# EAGLE design xmas-tree (EAGLE 7.5.0)
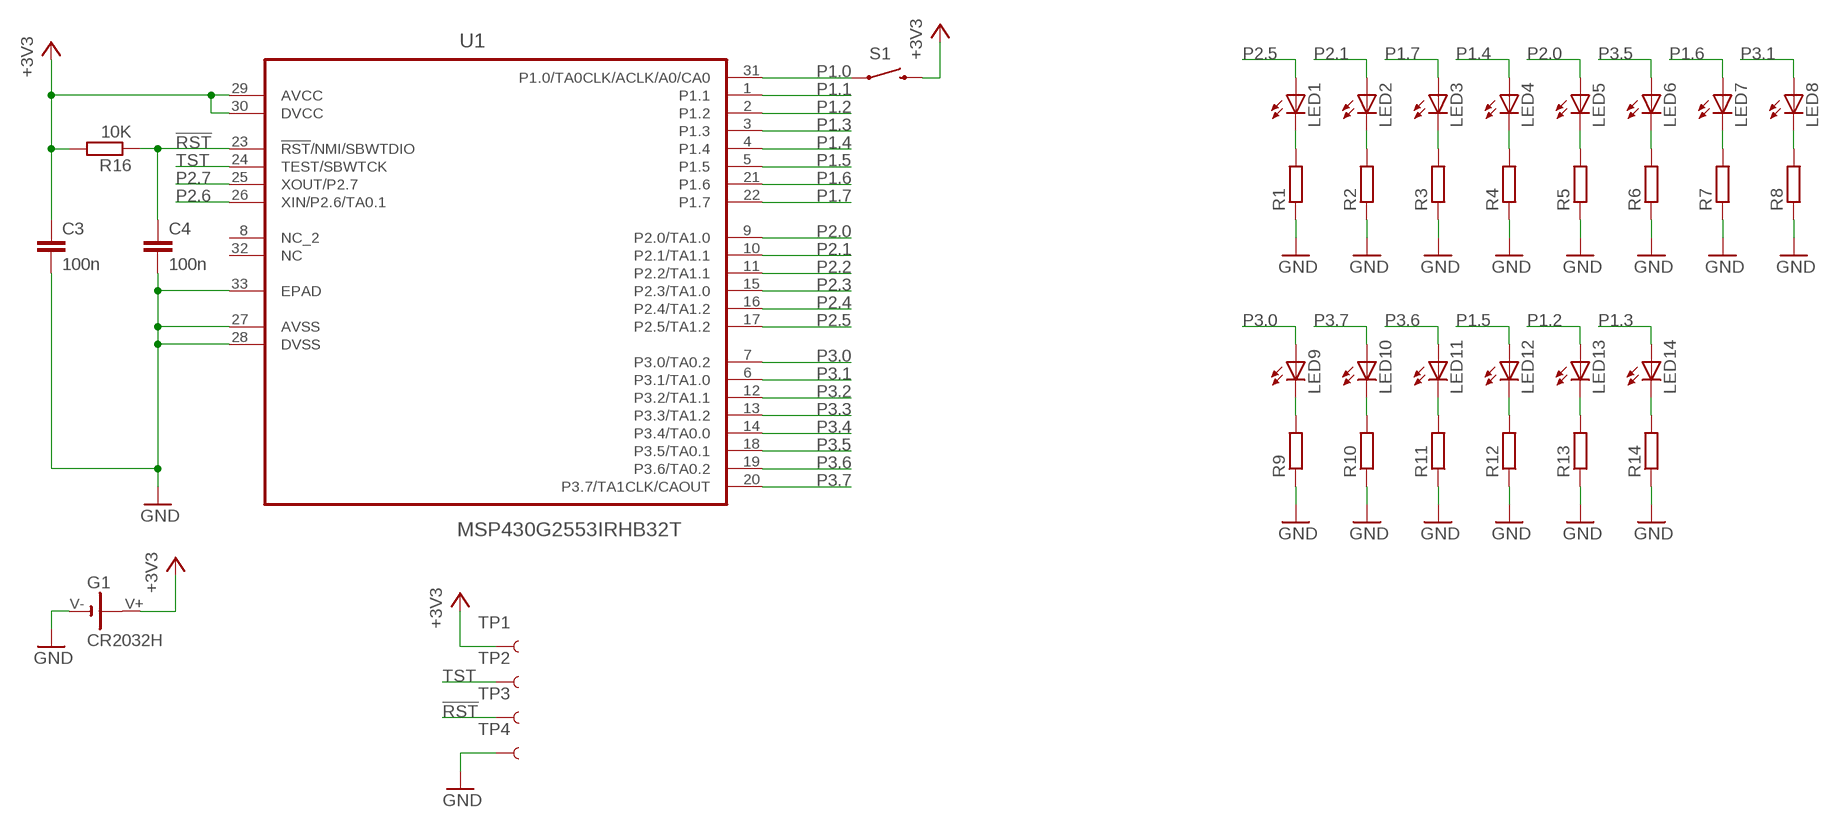
[diagram p0: schematic, sheet 1]

## Parts
C3  100n  C-EUC0603  [C0603]
C4  100n  C-EUC0603  [C0603]
G1  CR2032H  [CH7410-2032LF]
LED1  LEDCHIPLED_0603  [CHIPLED_0603]
LED2  LEDCHIPLED_0603  [CHIPLED_0603]
LED3  LEDCHIPLED_0603  [CHIPLED_0603]
LED4  LEDCHIPLED_0603  [CHIPLED_0603]
LED5  LEDCHIPLED_0603  [CHIPLED_0603]
LED6  LEDCHIPLED_0603  [CHIPLED_0603]
LED7  LEDCHIPLED_0603  [CHIPLED_0603]
LED8  LEDCHIPLED_0603  [CHIPLED_0603]
LED9  LEDCHIPLED_0603  [CHIPLED_0603]
LED10  LEDCHIPLED_0603  [CHIPLED_0603]
LED11  LEDCHIPLED_0603  [CHIPLED_0603]
LED12  LEDCHIPLED_0603  [CHIPLED_0603]
LED13  LEDCHIPLED_0603  [CHIPLED_0603]
LED14  LEDCHIPLED_0603  [CHIPLED_0603]
R1  R-EU_R0603  [R0603]
R2  R-EU_R0603  [R0603]
R3  R-EU_R0603  [R0603]
R4  R-EU_R0603  [R0603]
R5  R-EU_R0603  [R0603]
R6  R-EU_R0603  [R0603]
R7  R-EU_R0603  [R0603]
R8  R-EU_R0603  [R0603]
R9  R-EU_R0603  [R0603]
R10  R-EU_R0603  [R0603]
R11  R-EU_R0603  [R0603]
R12  R-EU_R0603  [R0603]
R13  R-EU_R0603  [R0603]
R14  R-EU_R0603  [R0603]
R16  10K  R-EU_R0603  [R0603]
S1  SWITCH-MOMENTARY-2SMD-REDUNDANT  [TACTILE-SWITCH-SMD]
TP1  +3V3  TEST-POINT3X5  [PAD.03X.05]
TP2  TST  TEST-POINT3X5  [PAD.03X.05]
TP3  RST  TEST-POINT3X5  [PAD.03X.05]
TP4  GND  TEST-POINT3X5  [PAD.03X.05]
U1  MSP430G2553IRHB32T  [QFN50P500X500X100-33N]

## Nets
!RST!: C4.1 R16.1 TP3.P$1 U1.23(!RST!/NMI/SBWTDIO)
+3V3: C3.1 G1.V+ R16.2 S1.3 S1.4 TP1.P$1 U1.29(AVCC) U1.30(DVCC)
GND: C3.2 C4.2 G1.V- R1.1 R2.1 R3.1 R4.1 R5.1 R6.1 R7.1 R8.1 R9.1 R10.1 R11.1 R12.1 R13.1 R14.1 TP4.P$1 U1.27(AVSS) U1.28(DVSS) U1.33(EPAD)
N$3: LED1.C R1.2
N$4: LED2.C R2.2
N$5: LED3.C R3.2
N$6: LED4.C R4.2
N$7: LED5.C R5.2
N$8: LED6.C R6.2
N$9: LED7.C R7.2
N$10: LED8.C R8.2
N$11: LED9.C R9.2
N$12: LED10.C R10.2
N$13: LED11.C R11.2
N$14: LED12.C R12.2
N$15: LED13.C R13.2
N$16: LED14.C R14.2
P1.0: S1.1 S1.2 U1.31(P1.0/TA0CLK/ACLK/A0/CA0)
P1.1: U1.1(P1.1)
P1.2: LED13.A U1.2(P1.2)
P1.3: LED14.A U1.3(P1.3)
P1.4: LED4.A U1.4(P1.4)
P1.5: LED12.A U1.5(P1.5)
P1.6: LED7.A U1.21(P1.6)
P1.7: LED3.A U1.22(P1.7)
P2.0: LED5.A U1.9(P2.0/TA1.0)
P2.1: LED2.A U1.10(P2.1/TA1.1)
P2.2: U1.11(P2.2/TA1.1)
P2.3: U1.15(P2.3/TA1.0)
P2.4: U1.16(P2.4/TA1.2)
P2.5: LED1.A U1.17(P2.5/TA1.2)
P2.6: U1.26(XIN/P2.6/TA0.1)
P2.7: U1.25(XOUT/P2.7)
P3.0: LED9.A U1.7(P3.0/TA0.2)
P3.1: LED8.A U1.6(P3.1/TA1.0)
P3.2: U1.12(P3.2/TA1.1)
P3.3: U1.13(P3.3/TA1.2)
P3.4: U1.14(P3.4/TA0.0)
P3.5: LED6.A U1.18(P3.5/TA0.1)
P3.6: LED11.A U1.19(P3.6/TA0.2)
P3.7: LED10.A U1.20(P3.7/TA1CLK/CAOUT)
TST: TP2.P$1 U1.24(TEST/SBWTCK)
Unconnected: U1.8(NC_2) U1.32(NC)

## Library data of the parts
C3 C4 = rcl:C-EU: CAPACITOR, European symbol
G1 = my_library:CR2032H: LI BATTERY Varta
LED1-LED14 = led:LED: LED OSRAM: - CHIPLED LG R971, LG N971, LY N971, LG Q971, LY Q971, LO R971, LY R971 LH N974, LH R974 LS Q976, LO Q976, LY Q976 LO Q996 - Hyper CHIPLED LW Q18S LB Q993, LB Q99A, LB R99A - SideLED LS A670, LO A670, LY A670, LG A670, LP A670 LB A673, LV A673, LT A673, LW A673 LH A674 LY A675 LS A676, LA A676, LO A676, LY A676, LW A676 LS A679, LY A679, LG A679 - Hyper Micro SIDELED® LS Y876, LA Y876, LO Y876, LY Y876 LT Y87S - SmartLED LW L88C, LW L88S LB L89C, LB L89S, LG L890 LS L89K, LO L89K, LY L89K LS L896, LA L896, LO L896, LY L896 - TOPLED LS T670, LO T670, LY T670, LG T670, LP T670 LSG T670, LSP T670, LSY T670, LOP T670, LYG T670 LG T671, LOG T671, LSG T671 LB T673, LV T673, LT T673, LW T673 LH T674 LS T676, LA T676, LO T676, LY T676, LB T676, LH T676, LSB T676, LW T676 LB T67C, LV T67C, LT T67C, LS T67K, LO T67K, LY T67K, LW E67C LS E67B, LA E67B, LO E67B, LY E67B, LB E67C, LV E67C, LT E67C LW T67C LS T679, LY T679, LG T679 LS T770, LO T770, LY T770, LG T770, LP T770 LB T773, LV T773, LT T773, LW T773 LH T774 LS E675, LA E675, LY E675, LS T675 LS T776, LA T776, LO T776, LY T776, LB T776 LHGB T686 LT T68C, LB T68C - Hyper Mini TOPLED® LB M676 - Mini TOPLED Santana® LG M470 LS M47K, LO M47K, LY M47K Source: http://www.osram.convergy.de LUXEON: - LUMILED® LXK2-PW12-R00, LXK2-PW12-S00, LXK2-PW14-U00, LXK2-PW14-V00 LXK2-PM12-R00, LXK2-PM12-S00, LXK2-PM14-U00 LXK2-PE12-Q00, LXK2-PE12-R00, LXK2-PE12-S00, LXK2-PE14-T00, LXK2-PE14-U00 LXK2-PB12-K00, LXK2-PB12-L00, LXK2-PB12-M00, LXK2-PB14-N00, LXK2-PB14-P00, LXK2-PB14-Q00 LXK2-PR12-L00, LXK2-PR12-M00, LXK2-PR14-Q00, LXK2-PR14-R00 LXK2-PD12-Q00, LXK2-PD12-R00, LXK2-PD12-S00 LXK2-PH12-R00, LXK2-PH12-S00 LXK2-PL12-P00, LXK2-PL12-Q00, LXK2-PL12-R00 Source: www.luxeon.com KINGBRIGHT: KA-3528ASYC Source: www.kingbright.com
R1-R14 R16 = rcl:R-EU_: RESISTOR, European symbol
S1 = SparkFun-Electromechanical:SWITCH-MOMENTARY-2: Various NO switches- pushbuttons, reed, etc; PROD_ID: SWCH-08247
TP1-TP4 = SparkFun-Passives:TEST-POINT: Bare copper test points for troubleshooting or ICT
U1 = custom_lbr:MSP430G2553IRHB32T: MIXED SIGNAL MICROCONTROLLER,QFN-32; MPN: MSP430G2553IRHB32T; OC_FARNELL: 1903590; OC_NEWARK: 48T4379; PACKAGE: QFN-32; SUPPLIER: TEXAS INSTRUMENTS

## Board
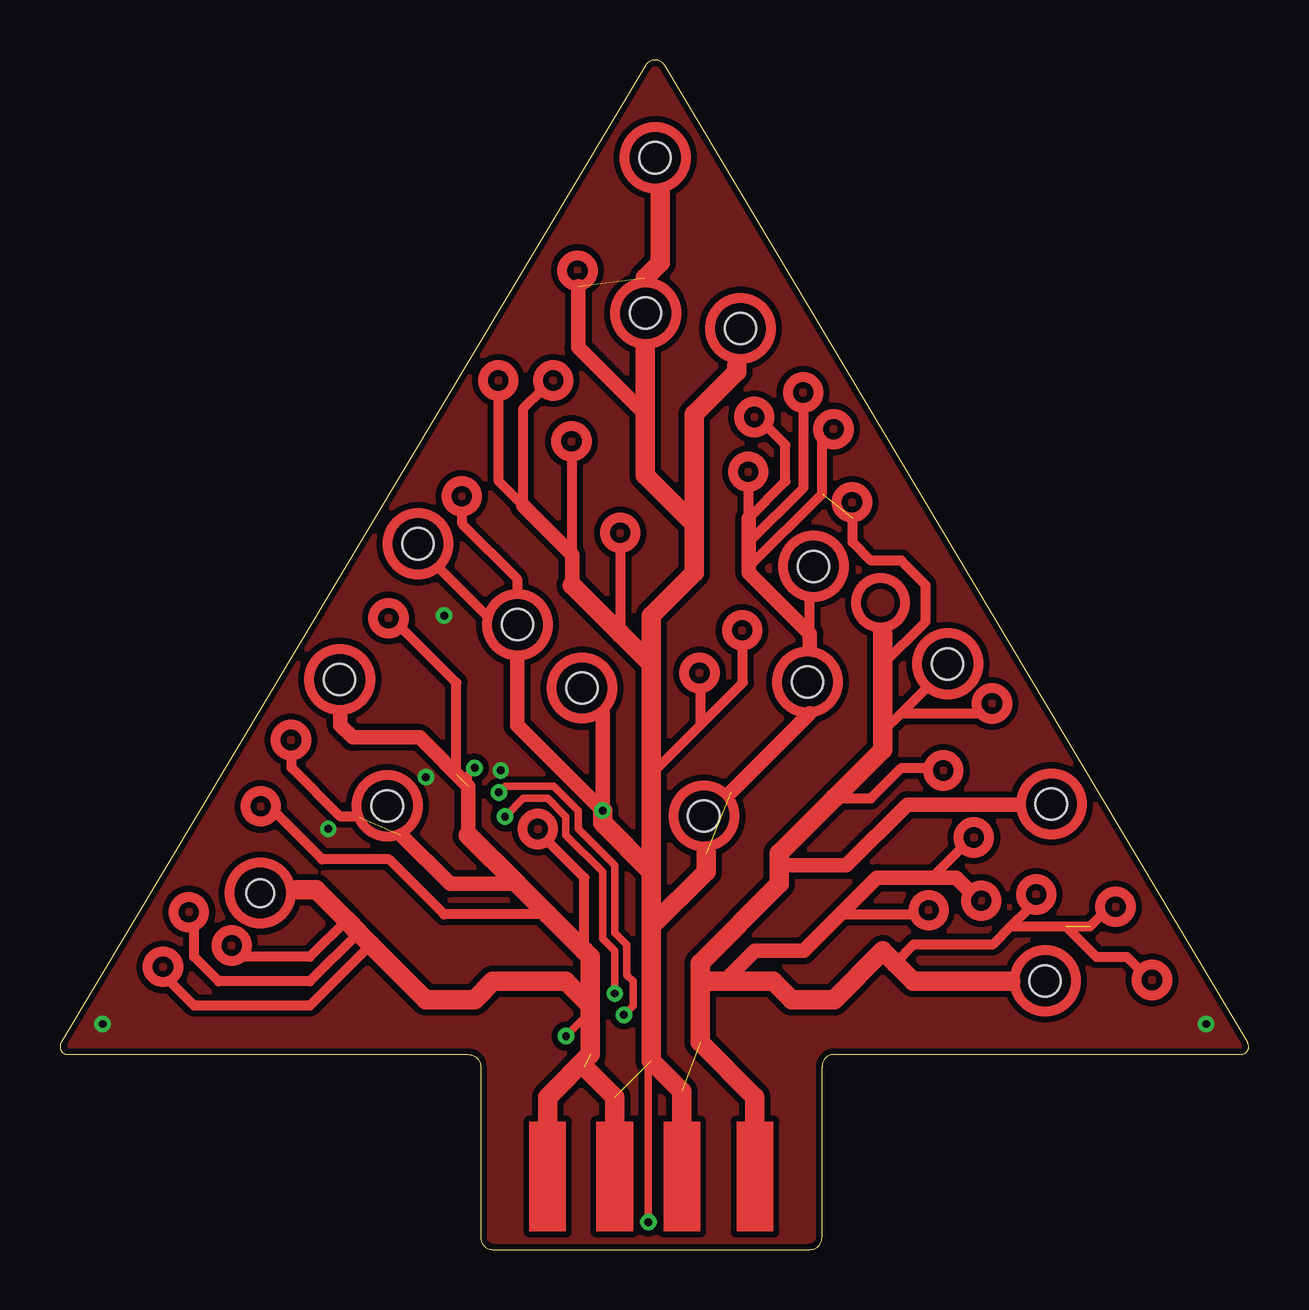
[diagram p1: board, top side]
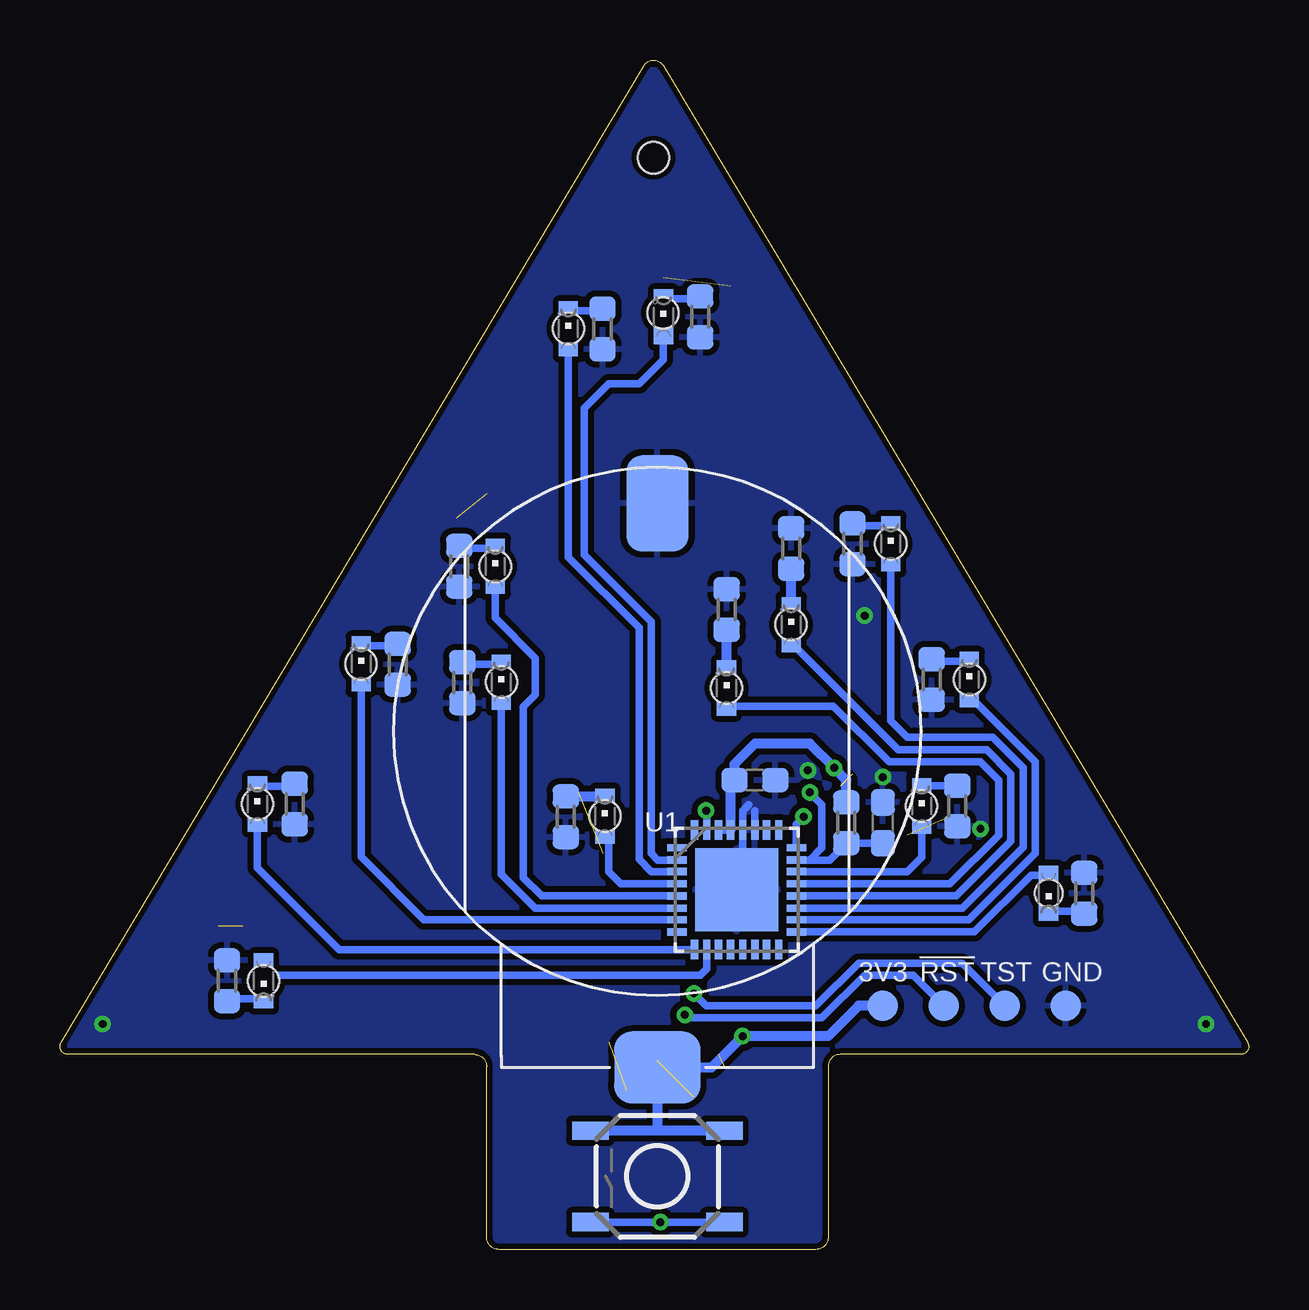
[diagram p2: board, bottom side, seen from below]

Size 49.53 x 49.56 mm. Coordinates in mm from the lower left corner, seen from the top.
Outline: 31.75,0.51 31.75,7.62 arc-90 32.26,8.13 49.2,8.13 arc121 49.48,8.63 25.19,49.34 arc118 24.4,49.34 0.05,8.63 arc121 0.33,8.13 17.02,8.13 arc-90 17.53,7.62 17.53,0.51 arc90 18.03,0 31.24,0 arc90 31.75,0.51
Copper layers (1*16): Top 0.0356mm / dielectric 1.5288mm / Bottom 0.0356mm
Design rules "OSHPARK_mod": minimum track width 6mil, minimum drill 13mil, track to track 6mil, track to pad 6mil, pad to pad 6mil, via to via 6mil, smd to smd 0mil, copper to edge 10mil, drill to drill 6mil, minimum pad ring 10mil, minimum via ring 7mil, stop-mask expansion 3mil, vias tented up to drill 20mil, thermal gap 10mil
Holes 1.3 mm at 13.63,18.48 11.64,23.76 26.82,18.06 19.06,26.04 21.76,23.39 14.92,29.41 31.14,23.64 31.4,28.47 36.98,24.4 41.05,11.2 41.3,18.56 28.35,38.37 24.4,39.01 24.8,45.49
Holes 1.15 mm at 8.34,14.85

### Footprints (pad centres in the part's own frame; a part is rotated, then mirrored left to right if it is on the bottom)
C0603 = smd 1.1 x 1: 1 -0.85,0; 2 0.85,0
CH7410-2032LF = smd 3 x 3.6: V+ -14,0 | smd 4 x 2.6: V- 9.5,0
CHIPLED_0603 = smd 0.8 x 0.8: A 0,-0.75; C 0,0.75
R0603 = smd 1 x 1.1: 1 -0.85,0; 2 0.85,0
TACTILE-SWITCH-SMD = smd 1.524 x 0.762: 1 -2.794,1.905; 2 2.794,1.905; 3 -2.794,-1.905; 4 2.794,-1.905
PAD.03X.05 = smd 1.27 x 1.27: P$1 0,0
QFN50P500X500X100-33N = smd 0.813 x 0.305: 1 -2.489,1.753; 2 -2.489,1.245; 3 -2.489,0.762; 4 -2.489,0.254; 5 -2.489,-0.254; 6 -2.489,-0.762; 7 -2.489,-1.245; 8 -2.489,-1.753; 17 2.489,-1.753; 18 2.489,-1.245; 19 2.489,-0.762; 20 2.489,-0.254; 21 2.489,0.254; 22 2.489,0.762; 23 2.489,1.245; 24 2.489,1.753 | smd 0.305 x 0.813: 9 -1.753,-2.489; 10 -1.245,-2.489; 11 -0.762,-2.489; 12 -0.254,-2.489; 13 0.254,-2.489; 14 0.762,-2.489; 15 1.245,-2.489; 16 1.753,-2.489; 25 1.753,2.489; 26 1.245,2.489; 27 0.762,2.489; 28 0.254,2.489; 29 -0.254,2.489; 30 -0.762,2.489; 31 -1.245,2.489; 32 -1.753,2.489 | smd 3.454 x 3.454: 33 0,0

### Placement (x,y rotation side)
C3  20.57,19.56 0 bottom
C4  15.24,17.78 90 bottom
G1  24.64,21.59 90 bottom
LED1  8.34,14.85 180 bottom
LED2  41.05,11.2 180 bottom
LED3  13.62,18.48 0 bottom
LED4  26.82,18.06 0 bottom
LED5  41.3,18.56 0 bottom
LED6  11.64,23.76 0 bottom
LED7  21.76,23.39 0 bottom
LED8  31.14,23.64 0 bottom
LED9  36.98,24.4 0 bottom
LED10  19.06,26.04 0 bottom
LED11  14.92,29.41 0 bottom
LED12  31.4,28.47 0 bottom
LED13  24.38,38.86 0 bottom
LED14  28.35,38.36 0 bottom
R1  6.86,14.85 270 bottom
R2  42.57,11.2 270 bottom
R3  12.14,18.48 90 bottom
R4  28.45,18.03 90 bottom
R5  39.75,18.57 90 bottom
R6  13.21,23.76 90 bottom
R7  21.76,26.67 270 bottom
R8  32.77,23.62 90 bottom
R9  35.46,24.38 90 bottom
R10  19.06,29.21 270 bottom
R11  16.51,29.41 90 bottom
R12  32.89,28.47 90 bottom
R13  22.86,38.86 90 bottom
R14  26.92,38.35 90 bottom
R16  16.76,17.78 90 bottom
S1  24.64,3.05 180 bottom
TP1  15.24,10.16 270 bottom
TP2  10.16,10.16 270 bottom
TP3  12.7,10.16 270 bottom
TP4  7.62,10.16 270 bottom
U1  21.34,14.99 0 bottom

### Tracks (layer width: path | path; a pad name or v marks a point on that pad's centre or on a via)
!RST!  (via drill 0.33)
  Top 0.305: v18.29,19.05 18.54,19.3 20.57,19.3 21.59,18.29 21.59,17.53 23.11,16 23.11,13.21 23.62,12.7 23.62,11.43 23.88,11.18 23.88,10.16 v23.5,9.78
  Bottom 0.305: C4.1 R16.1 17.46,16.23 18.29,16.23 | v18.29,19.05 17.78,18.54 17.78,16.74 18.29,16.23 | v23.5,9.78 23.37,9.65 17.78,9.65 16,11.43 13.97,11.43 TP3.P$1 | U1.23 18.29,16.23
+3V3  (via drill 0.33)
  Top 0.305: v17.27,20.07 17.02,19.81 17.02,17.27 22.1,12.19 22.1,9.91 v21.08,8.89
  Bottom 0.305: U1.29 U1.30
  Bottom 0.406: S1.3 24.64,4.95 | 24.64,4.95 S1.4 | 24.64,4.95 G1.V+ 22.38,7.59 v21.08,8.89 17.53,8.89 16.26,10.16 TP1.P$1 | R16.2 16.76,19.56 v17.27,20.07 18.29,21.08 20.57,21.08 21.42,20.23 C3.1 21.59,19.39 U1.29
GND  (via drill 0.33)
  Bottom 0.305: U1.27 20.57,18.29 | U1.33 21.34,16.26 21.08,16.51 U1.28 21.08,18.29 20.83,18.54
  other vias: 1.78,9.4 11.18,17.53 15.24,19.68 18.37,19.96 16,26.42 47.75,9.4
  pour Top (isolate 0.254): 49.47,8.67 25.58,49.13 arc119 24.2,49.13 0.07,8.67 arc121 0.38,8.13 16.96,8.13 arc-90 17.53,7.56 17.53,0.57 arc90 18.09,0 31.18,0 arc90 31.75,0.57 31.75,7.56 arc-90 32.32,8.13 49.16,8.13 arc121
  pour Bottom (isolate 0.254): 49.47,8.67 25.58,49.13 arc119 24.2,49.13 0.07,8.67 arc121 0.38,8.13 16.96,8.13 arc-90 17.53,7.56 17.53,0.57 arc90 18.09,0 31.18,0 arc90 31.75,0.57 31.75,7.56 arc-90 32.32,8.13 49.16,8.13 arc121
N$1
  Top 0.406: 17.78,26.42 15.75,28.45
N$2
  Top 0.406: 16.76,30.73 16.76,30.23 19.05,27.94 19.05,27.43
N$3
  Bottom 0.305: LED1.C 6.96,14.1 R1.2
N$4
  Bottom 0.305: LED2.C 42.55,10.45 R2.2
N$5
  Bottom 0.305: R3.2 13.52,19.33 LED3.C
N$6
  Bottom 0.406: R4.2 27.05,18.88 LED4.C
N$7
  Bottom 0.305: LED5.C 39.86,19.31 R5.2
N$8
  Bottom 0.305: LED6.C 13.11,24.5 R6.2
N$9
  Bottom 0.406: LED7.C R7.2
N$10
  Bottom 0.305: LED8.C 32.69,24.39 R8.2
N$11
  Bottom 0.305: LED9.C 35.54,25.15 R9.2
N$12
  Bottom 0.406: LED10.C R10.2
N$13
  Bottom 0.305: LED11.C 16.41,30.16 R11.2
N$14
  Bottom 0.305: LED12.C 32.79,29.22 R12.2
N$15
  Bottom 0.305: LED13.C 22.96,39.61 R13.2
N$16
  Bottom 0.305: LED14.C 27.02,39.11 R14.2
P1.0  (via drill 0.33)
  Top 0.305: v22.61,18.29 22.61,17.78 24.51,15.88 v24.51,1.14
  Bottom 0.305: S1.2 v24.51,1.14 S1.1 | U1.31 22.58,18.26 v22.61,18.29
P1.2
  Bottom 0.305: U1.2 24.61,16.23 24.89,16.51 24.89,26.16 27.69,28.96 27.69,35.05 26.67,36.07 25.4,36.07 24.38,37.08 LED13.A
P1.3
  Bottom 0.305: U1.3 24.89,15.75 25.4,16.26 25.4,25.91 28.35,28.85 LED14.A
P1.4
  Bottom 0.305: U1.4 26.16,15.24 26.67,15.75 26.67,17.16 LED4.A
P1.5
  Bottom 0.305: U1.5 29.46,14.73 30.23,15.49 30.23,22.61 29.72,23.11 29.72,24.64 31.39,26.31 LED12.A
P1.6
  Bottom 0.305: U1.21 12.45,15.24 10.41,17.27 10.41,19.56 11.18,20.32 14.99,20.32 17.31,22.64 LED7.A
P1.7
  Bottom 0.305: U1.22 14.22,15.75 13.62,16.35 LED3.A
P2.0
  Bottom 0.305: U1.9 37.9,12.5 41.3,15.9 LED5.A
P2.1
  Bottom 0.305: U1.10 22.58,11.71 22.86,11.43 40.53,11.43 LED2.A
P2.5
  Bottom 0.305: U1.17 11.43,13.23 9.07,15.6 LED1.A
P3.0
  Bottom 0.305: LED9.A 36.98,16.36 34.37,13.74 U1.7
P3.1
  Bottom 0.305: U1.6 29.72,14.22 31.14,15.65 LED8.A
P3.5
  Bottom 0.305: U1.18 11.66,13.74 8.89,16.51 8.89,20.32 11.58,23 LED6.A
P3.6
  Bottom 0.305: U1.19 11.94,14.22 9.4,16.76 9.4,20.07 10.67,21.34 14.22,21.34 14.92,22.03 LED11.A
P3.7
  Bottom 0.305: U1.20 12.19,14.73 9.91,17.02 9.91,19.81 10.92,20.83 14.61,20.83 LED10.A
TREE  (9 unrouted)
  Top 0.406: 21.84,12.45 21.84,15.49 20.32,17.02 | 11.94,13.72 10.41,12.19 7.62,12.19 | 12.45,13.21 10.41,11.18 6.6,11.18 5.59,12.19 5.59,13.46 | 20.32,13.97 16,13.97 13.72,16.26 10.92,16.26 8.97,18.21 | 12.95,12.7 10.41,10.16 5.59,10.16 4.57,11.18 | 21.34,28.96 21.34,32.77 | 18.29,35.56 18.29,32 19.3,30.99 19.3,35.05 20.07,35.81 | 23.37,25.65 23.37,29.21 | 24.64,19.81 26.67,21.84 | 26.67,21.84 28.45,23.62 28.45,25.15 | 26.67,23.37 26.67,21.84 | 34.29,24.38 36.07,26.16 36.07,27.69 35.05,28.7 33.78,28.7 33.02,29.46 33.02,30.48 | 34.29,21.59 35.05,22.35 | 35.05,22.35 36.07,23.37 | 35.05,22.35 38.35,22.35 | 32.26,18.8 33.78,18.8 35.05,20.07 36.07,20.07 | 39.62,13.46 40.39,14.22 | 36.32,15.49 37.59,16.76 | 39.62,13.46 42.93,13.46 43.43,13.97 | 41.91,13.46 43.18,12.19 44.45,12.19 44.96,11.68 | 12.45,18.03 11.68,18.03 9.65,20.07 9.65,20.57 | 16.51,19.81 16.51,23.62 14.32,25.81 | 31.24,25.65 31.24,27.18 | 28.7,31.75 28.7,30.48 30.23,32 30.23,33.53 29.46,34.29 | 28.7,29.46 30.99,31.75 30.99,35.05 | 28.7,28.45 31.75,31.5 31.75,33.78 | 39.62,13.46 38.86,12.7 35.56,12.7 34.8,11.94 | 32.51,13.97 35.56,13.97
  Top 0.61: 17.02,17.27 17.02,19.3 14.99,21.34 12.19,21.34 11.68,21.84 11.68,22.35 | 19.05,15.24 16.26,15.24 14.22,17.27 | 21.59,40.13 21.59,37.59 24.38,34.8 | 22.61,22.35 22.61,18.29 19.05,21.84 19.05,24.64 | 21.34,27.69 21.34,28.96 19.3,30.99 | 29.97,16 32.77,16 35.31,18.54 39.88,18.54 | 27.69,11.18 28.96,12.45 30.99,12.45 32.51,13.97 34.04,15.49 36.32,15.49 37.34,15.49 37.85,14.99 | 27.94,19.05 31.24,22.35 | 31.24,25.15 31.24,25.65 28.7,28.19 28.7,28.45 28.7,29.46 28.7,30.48
  Top 0.813: 20.32,5.33 20.32,6.35 22.1,8.13 22.1,10.16 | 22.1,10.16 22.1,12.19 21.84,12.45 20.32,13.97 19.05,15.24 17.02,17.27 | 22.1,10.16 21.08,11.18 18.03,11.18 17.27,10.41 15.24,10.41 12.95,12.7 12.45,13.21 11.94,13.72 10.67,14.99 9.89,14.99 | 25.91,5.33 25.91,6.6 24.64,7.87 24.64,13.46 | 24.64,13.46 24.64,15.75 | 24.64,15.75 24.64,19.81 24.64,24.38 | 24.64,24.38 24.64,26.42 26.42,28.19 26.42,30.23 | 26.42,30.23 26.42,34.8 28.19,36.58 28.19,36.83 | 26.42,30.23 24.38,32.26 24.38,34.8 24.38,37.54 | 24.64,15.75 22.61,17.78 22.61,18.29 | 24.64,24.38 23.37,25.65 21.34,27.69 | 24.64,13.46 26.92,15.75 26.92,16.51 | 28.96,5.33 28.96,6.35 26.67,8.64 26.67,11.18 | 26.67,11.18 26.67,11.94 29.97,15.24 29.97,16 29.97,16.51 32.26,18.8 34.29,20.83 34.29,21.59 34.29,24.38 34.29,25.65 | 26.67,11.18 27.69,11.18 29.72,11.18 30.48,10.41 32.26,10.41 34.29,12.45 34.8,11.94 35.56,11.18 39.62,11.18 | 23.11,5.33 23.11,6.35 21.84,7.62 | 25.02,44.02 25.02,41.12 24.38,40.49
TST  (via drill 0.33)
  Top 0.305: v18.54,18.03 19.3,18.8 20.32,18.8 21.08,18.03 21.08,17.27 22.61,15.75 22.61,12.95 23.11,12.45 v23.11,10.67
  Bottom 0.305: U1.24 18.85,17.73 v18.54,18.03 | TP2.P$1 11.94,11.94 16.26,11.94 18.03,10.16 22.61,10.16 v23.11,10.67
(copper drawn outside any net)
  shapes: Top area x4, Top circle x44

### Text on the board
bNames: GND | TST | !RST! | 3V3